# Altium project ahrs.PrjPCB
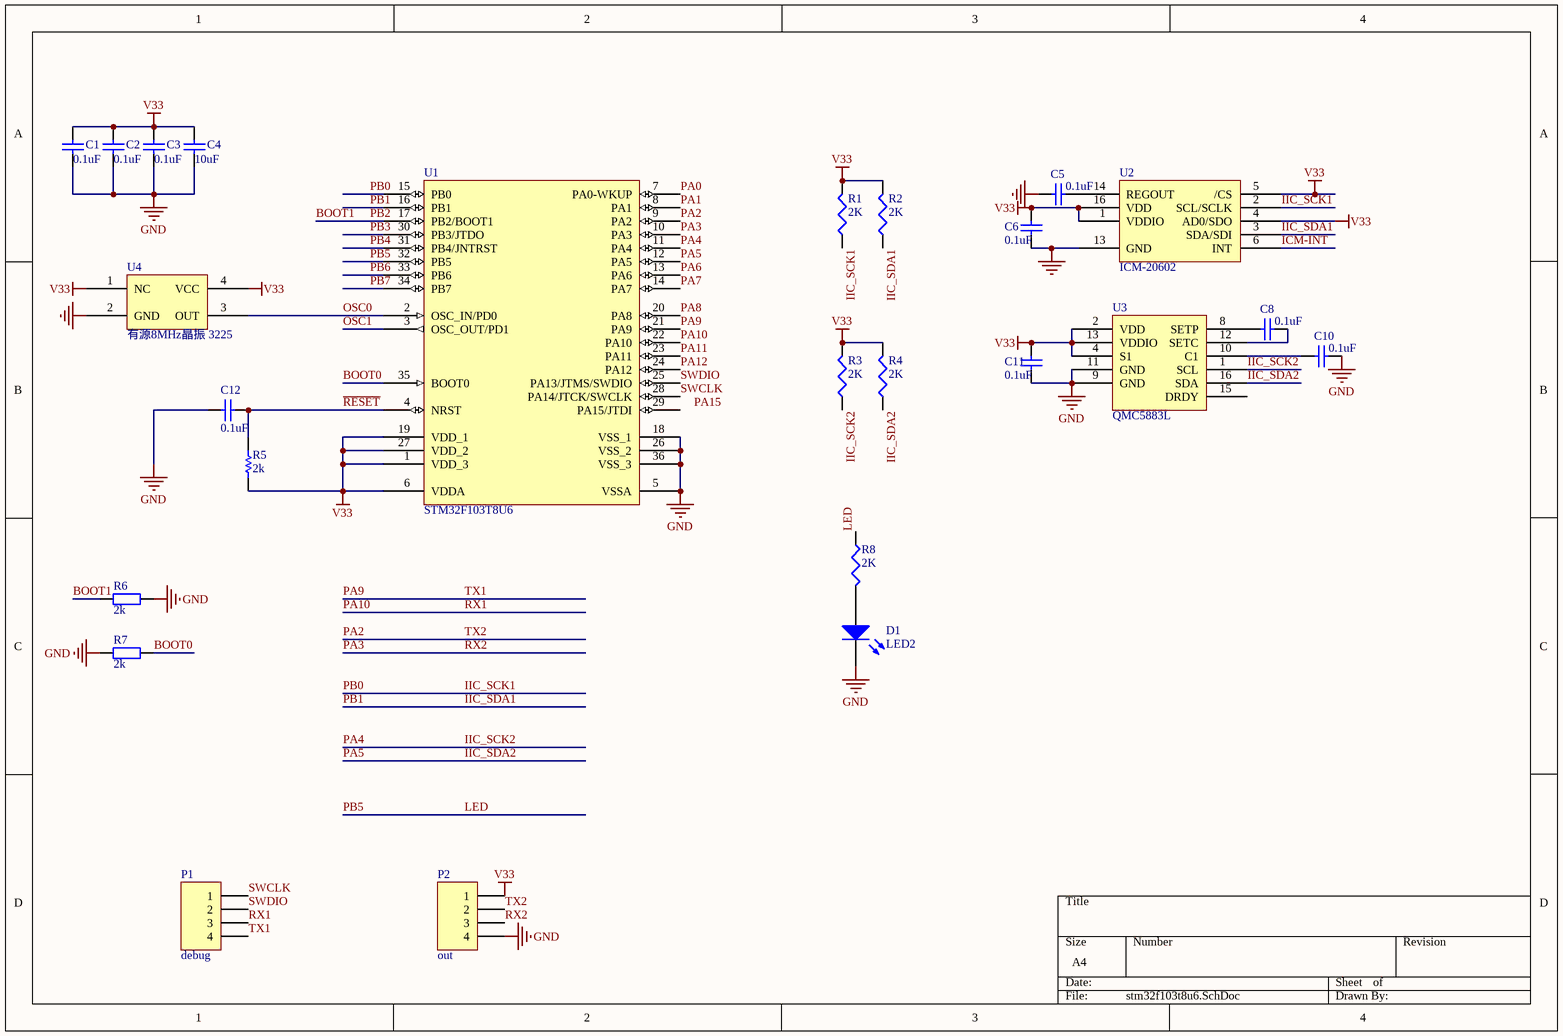
[diagram p0: stm32f103t8u6.SchDoc]
1 sheet, 25 parts. Net scope: global (net labels, ports and power ports of the same name join across sheets).
Board file: ahrsV1.0.PcbDoc

## Sheet stm32f103t8u6.SchDoc
size A4

### Parts
C1  value 0.1uF  [0402]  (hidden comment: Cap)
C2  value 0.1uF  [0402]  (hidden comment: Cap)
C3  value 0.1uF  [0402]  (hidden comment: Cap)
C4  value 10uF  [1608[0603]]  (hidden comment: Cap)
C5  0.1uF  [0402]
C6  0.1uF  [0402]
C8  value 0.1uF  [0402]  (hidden comment: Cap)
C10  value 0.1uF  [0402]  (hidden comment: Cap)
C11  0.1uF  [0402]
C12  value 0.1uF  [0402]  (hidden comment: Cap)
D1  LED2  [J1-0603]
P1  debug  [HDR1X4]
P2  out  [HDR1X4]
R1  2K  [0402]
R2  2K  [0402]
R3  2K  [0402]
R4  2K  [0402]
R5  value 2k  [0402]  (hidden comment: Res Semi)
R6  value 2k  [0402]  (hidden comment: Res2)
R7  value 2k  [0402]  (hidden comment: Res2)
R8  2K  [0402]
U1  STM32F103T8U6  [VFQN-36]
U2  ICM-20602  [LC-LGA-16_3x3mm]
U3  QMC5883L  [PCBComponent_1]
U4  有源8MHz晶振 3225  [有源贴片晶振(3225)]

### Nets
GND: C1.1 C2.1 C3.1 C4.1 C5.2 C6.2 C10.2 C11.2 C12.2 D1.2(K) P2.4 R6.1 R7.2 U1.5(VSSA) U1.18(VSS_1) U1.26(VSS_2) U1.36(VSS_3) U2.8(FSYNC) U2.9(RESV) U2.10(RESV) U2.11(RESV) U2.12(RESV) U2.13(GND) U2.15(RESV) U3.9(GND) U3.11(GND) U4.2(GND)
V33: C1.2 C2.2 C3.2 C4.2 C6.1 C11.1 P2.1 R1.1 R2.1 R3.1 R4.1 R5.1 U1.1(VDD_3) U1.6(VDDA) U1.19(VDD_1) U1.27(VDD_2) U2.1(VDDIO) U2.4(AD0/SDO) U2.5(/CS) U2.16(VDD) U3.2(VDD) U3.4(S1) U3.13(VDDIO) U4.1(NC) U4.4(VCC)
BOOT0: R7.1 U1.35(BOOT0)
BOOT1: R6.2 U1.17(PB2/BOOT1)  [also labelled PB2]
ICM-INT: U2.6(INT)
IIC_SCK1: R1.2 U1.15(PB0) U2.2(SCL/SCLK)  [also labelled PB0]
IIC_SCK2: R3.2 U1.11(PA4) U3.1(SCL)  [also labelled PA4]
IIC_SDA1: R2.2 U1.16(PB1) U2.3(SDA/SDI)  [also labelled PB1]
IIC_SDA2: R4.2 U1.12(PA5) U3.16(SDA)  [also labelled PA5]
LED: R8.2 U1.32(PB5)  [also labelled PB5]
OSC0: U1.2(OSC_IN/PD0) U4.3(OUT)
OSC1: U1.3(OSC_OUT/PD1)
PA0: U1.7(PA0-WKUP)
PA1: U1.8(PA1)
PA2: P2.2 U1.9(PA2)  [also labelled TX2]
PA3: P2.3 U1.10(PA3)  [also labelled RX2]
PA6: U1.13(PA6)
PA7: U1.14(PA7)
PA8: U1.20(PA8)
PA9: P1.4 U1.21(PA9)  [also labelled TX1]
PA10: P1.3 U1.22(PA10)  [also labelled RX1]
PA11: U1.23(PA11)
PA12: U1.24(PA12)
PB3: U1.30(PB3/JTDO)
PB4: U1.31(PB4/JNTRST)
PB6: U1.33(PB6)
PB7: U1.34(PB7)
~{RESET}: C12.1 R5.2 U1.4(NRST)
SWCLK: P1.1 U1.28(PA14/JTCK/SWCLK)
SWDIO: P1.2 U1.25(PA13/JTMS/SWDIO)
NetC5_1: C5.1 U2.14(REGOUT)
NetC8_1: C8.1 U3.8(SETP)
NetC8_2: C8.2 U3.12(SETC)
NetC10_1: C10.1 U3.10(C1)
NetD1_1: D1.1(A) R8.1

Not connected (* = marked no-connect by the designer): U1 29(PA15/JTDI); U3 15(DRDY)

### Notes on the sheet
- Labels drawn without touching a wire or pin: PA15

### Library data of the parts
C1-C4 C8 C10 C12 = Cap: Capacitor; Published: 8-Jun-2000; LatestRevisionDate: 17-Jul-2002; LatestRevisionNote: Re-released for DXP Platform.; PackageReference: RAD-0.3; Publisher: Altium Limited
  C8 C10: PackageDescription: Radial Cap, Thru-Hole; 2 Leads; 0.3 in Pin Spacing
C5 C6 C11 = Cap Semi: Capacitor (Semiconductor SIM Model); Value: 10nF X7R 16V 5% 0603; Published: 8-Jun-2000; LatestRevisionDate: 29-May-2009; LatestRevisionNote: IPC-7351 Footprint Added.; PackageReference: C1206; Publisher: Altium Limited; PackageDescription: Chip Capacitor
D1 = LED2: Typical RED, GREEN, YELLOW, AMBER GaAs LED; Published: 8-Jun-2000; LatestRevisionDate: 17-Jul-2002; LatestRevisionNote: Re-released for DXP Platform.; PackageVersion: Feb-2002; PackageReference: 3.2X1.6X1.1; Publisher: Altium Limited; PackageDescription: SM LED; 2 Flat Leads
P1 P2 = Header 4: Header, 4-Pin; LatestRevisionDate: 17-Jul-2002; LatestRevisionNote: Re-released for DXP Platform.; Publisher: Altium Limited
R1-R4 R8 = Res3: Resistor; Value: 10K 0.1W 5% 0603; Published: 8-Jun-2000; LatestRevisionDate: 29-May-2009; LatestRevisionNote: IPC-7351 Footprint Added.; PackageReference: J1-0603; Publisher: Altium Limited; PackageDescription: Chip Resistor
R5 = Res Semi: Semiconductor Resistor; Published: 8-Jun-2000; LatestRevisionDate: 17-Jul-2002; LatestRevisionNote: Re-released for DXP Platform.; PackageReference: AXIAL-0.5; Publisher: Altium Limited
R6 R7 = Res2: Resistor; Published: 8-Jun-2000; LatestRevisionDate: 17-Jul-2002; LatestRevisionNote: Re-released for DXP Platform.; PackageReference: AXIAL-0.4; Publisher: Altium Limited
U1 = STM32F103T8U6: STM32 ARM-based 32-bit MCU with 64 Kbytes Flash, 36-pin VFQFPN, Industrial Temperature; Published: 30-May-2008; DatasheetVersion: rev6, Mar-2008; PackageVersion: Mar-2008; PackageReference: VFQN36; Publisher: Altium Limited; PackageDescription: 36-Pin Quad Flat No-Lead, 6 x 6 X 1.0 mm Body, 0.5 mm Pitch, Exposed Pad (VFQN36); ComponentLink1Description: Manufacturer Link; ComponentLink1URL: www.st.com/stm32; ComponentLink2Description: Datasheet; ComponentLink2URL: http://www.st.com/stonline/products/literature/ds/13587.pdf
U4 = 贴片有源晶振